# EAGLE design Lampduino-SMD-v001 (EAGLE 6.0)
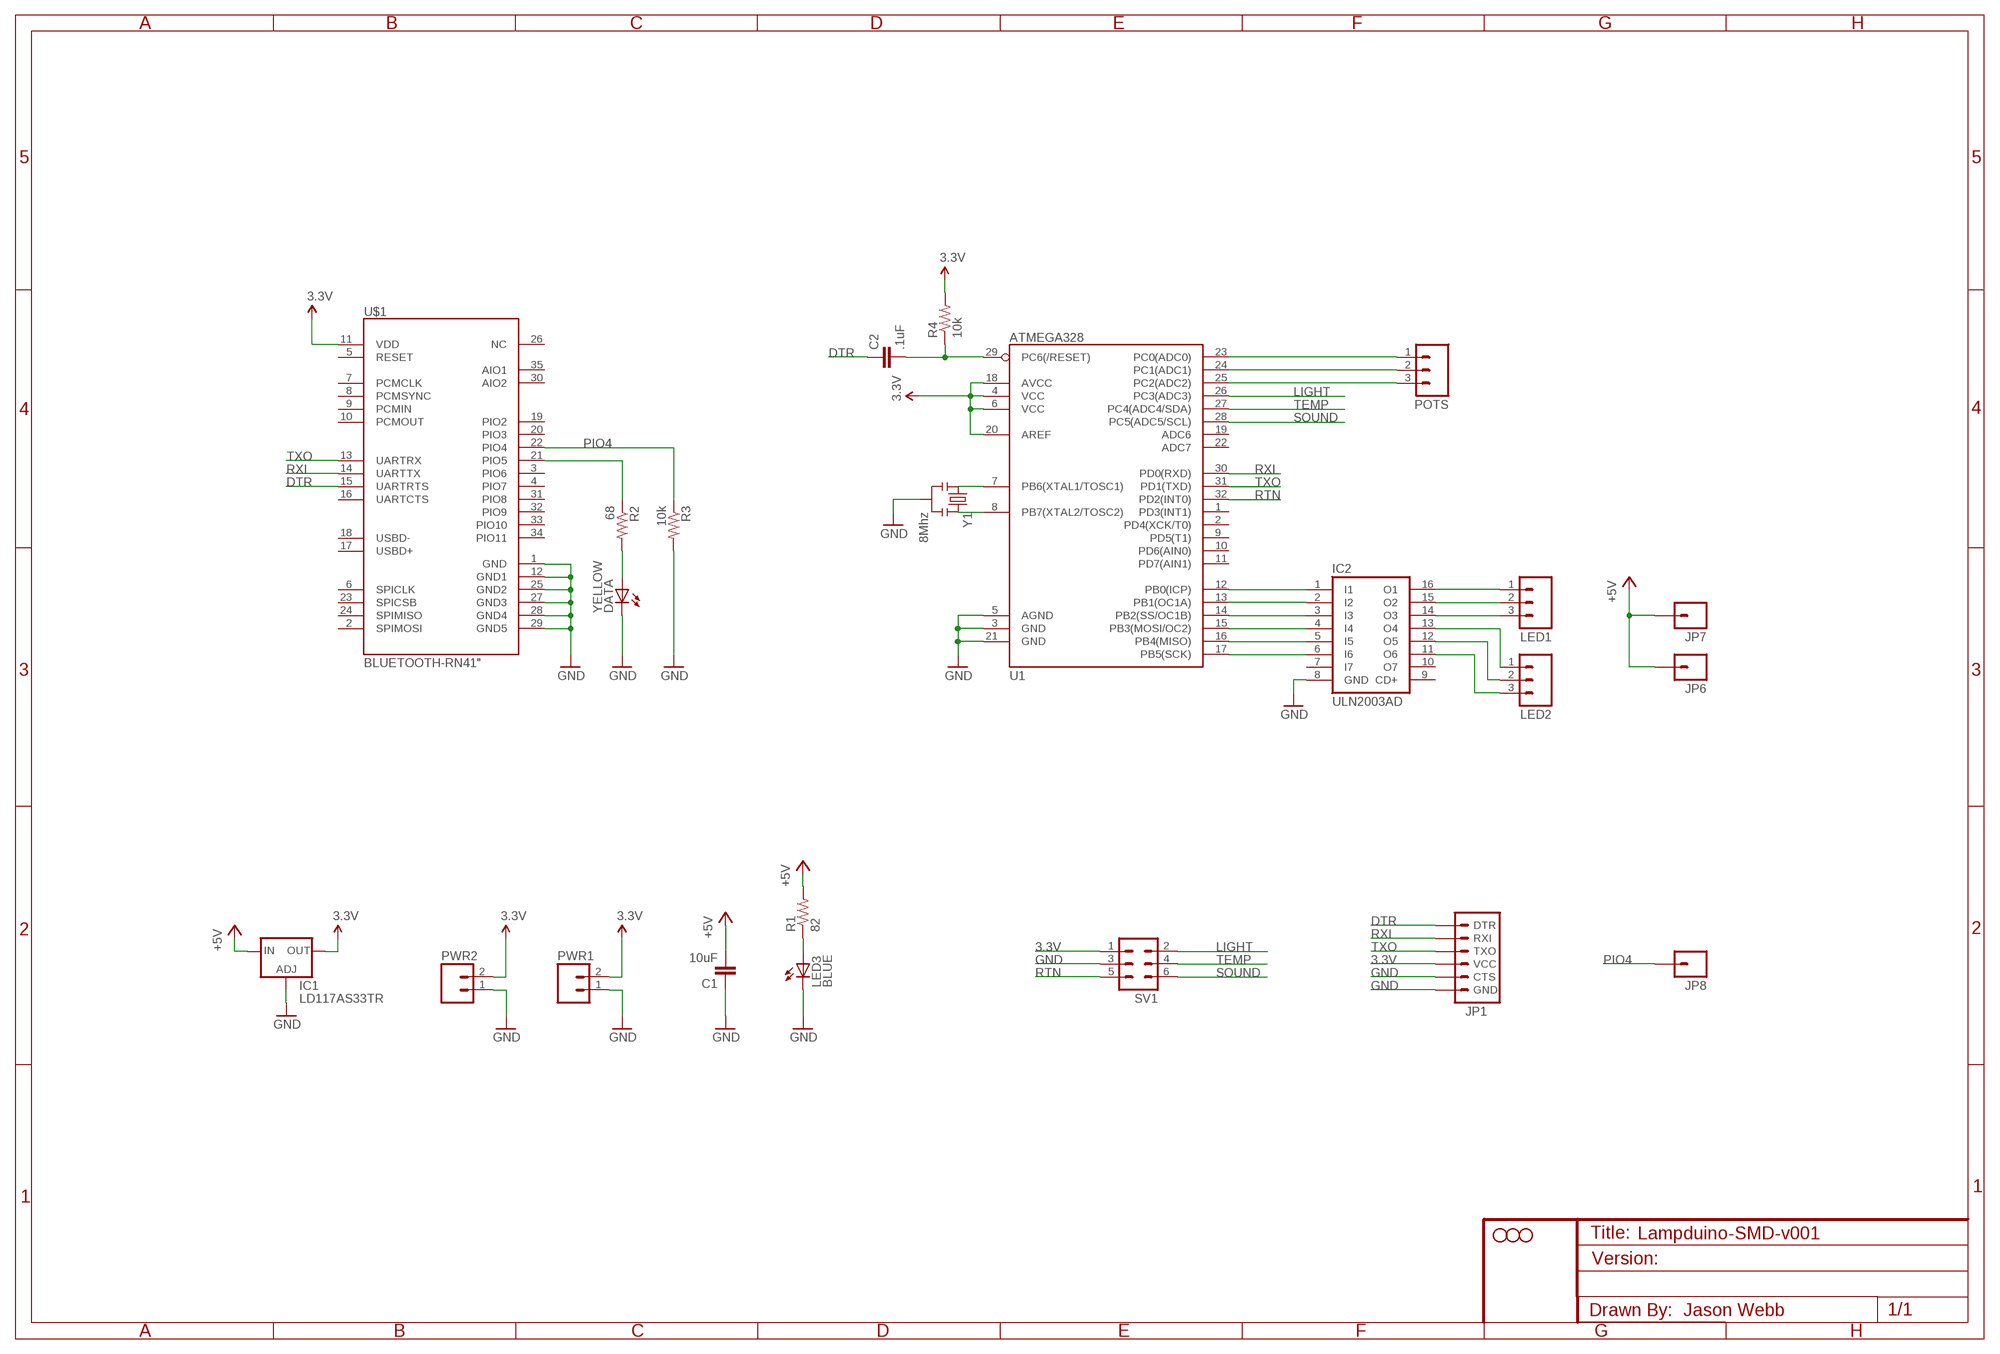
[diagram p0: schematic, sheet 1]

## Parts
C1  10uF  CAP0805  [0805]
C2  .1uF  CAP0805  [0805]
DATA  YELLOW  LEDCHIPLED_0603  [CHIPLED_0603]
IC1  LD117AS33TR  [SOT223]
IC2  ULN2003AD  [SO16]
JP1  ARDUINO_SERIAL_PROGRAMLOCK  [1X06_LOCK]
JP2  STAND-OFFTIGHT  [STAND-OFF-TIGHT]
JP4  STAND-OFFTIGHT  [STAND-OFF-TIGHT]
JP5  STAND-OFFTIGHT  [STAND-OFF-TIGHT]
JP6  M01PTH  [1X01]
JP7  M01PTH  [1X01]
JP8  M01PTH  [1X01]
LED1  M03PTH  [1X03]
LED2  M03PTH  [1X03]
LED3  BLUE  LEDCHIPLED_0603  [CHIPLED_0603]
POTS  M03PTH  [1X03]
PWR1  M02PTH  [1X02]
PWR2  M02PTH  [1X02]
R1  82  R-US_R0603  [R0603]
R2  68  R-US_R0603  [R0603]
R3  10k  R-US_R0603  [R0603]
R4  10k  R-US_R0603  [R0603]
SV1  ML6  [ML6]
U1  ATMEGA328  ATMEGA168  [TQFP32-08]
U$1  BLUETOOTH-RN41"  [RN41]
Y1  8Mhz  RESONATORSMD  [RESONATOR-SMD]

## Nets
3.3V: IC1.4(OUT) JP1.4(VCC) PWR1.2 PWR2.2 R4.2 SV1.1 U1.4(VCC) U1.6(VCC) U1.18(AVCC) U1.20(AREF) U$1.11(VDD)
+5V: C1.2 IC1.3(IN) JP6.1 JP7.1 R1.2
DTR: C2.1 JP1.1(DTR) U$1.15(UARTRTS)
GND: C1.1 DATA.C IC1.1(ADJ) IC2.8(GND) JP1.5(CTS) JP1.6(GND) LED3.C PWR1.1 PWR2.1 R3.2 SV1.3 U1.3(GND) U1.5(AGND) U1.21(GND) U$1.1(GND) U$1.12(GND1) U$1.25(GND2) U$1.27(GND3) U$1.28(GND4) U$1.29(GND5) Y1.2
LIGHT: SV1.2 U1.26(PC3(ADC3))
N$1: IC2.15(O2) LED1.2
N$2: IC2.4(I4) U1.15(PB3(MOSI/OC2))
N$3: IC2.14(O3) LED1.3
N$4: IC2.5(I5) U1.16(PB4(MISO))
N$5: IC2.16(O1) LED1.1
N$6: IC2.6(I6) U1.17(PB5(SCK))
N$7: U1.7(PB6(XTAL1/TOSC1)) Y1.1
N$8: U1.8(PB7(XTAL2/TOSC2)) Y1.3
N$9: LED3.A R1.1
N$10: C2.2 R4.1 U1.29(PC6(/RESET))
N$11: R2.1 U$1.21(PIO5)
N$12: POTS.3 U1.25(PC2(ADC2))
N$13: IC2.1(I1) U1.12(PB0(ICP))
N$14: IC2.2(I2) U1.13(PB1(OC1A))
N$15: IC2.3(I3) U1.14(PB2(SS/OC1B))
N$16: DATA.A R2.2
N$17: IC2.13(O4) LED2.1
N$18: IC2.12(O5) LED2.2
N$19: IC2.11(O6) LED2.3
N$20: POTS.2 U1.24(PC1(ADC1))
N$22: POTS.1 U1.23(PC0(ADC0))
PIO4: JP8.1 R3.1 U$1.22(PIO4)
RTN: SV1.5 U1.32(PD2(INT0))
RXI: JP1.2(RXI) U1.30(PD0(RXD)) U$1.14(UARTTX)
SOUND: SV1.6 U1.28(PC5(ADC5/SCL))
TEMP: SV1.4 U1.27(PC4(ADC4/SDA))
TXO: JP1.3(TXO) U1.31(PD1(TXD)) U$1.13(UARTRX)
Unconnected: IC2.7(I7) IC2.9(CD+) IC2.10(O7) U1.1(PD3(INT1)) U1.2(PD4(XCK/T0)) U1.9(PD5(T1)) U1.10(PD6(AIN0)) U1.11(PD7(AIN1)) U1.19(ADC6) U1.22(ADC7) U$1.2(SPIMOSI) U$1.3(PIO6) U$1.4(PIO7) U$1.5(RESET) U$1.6(SPICLK) U$1.7(PCMCLK) U$1.8(PCMSYNC) U$1.9(PCMIN) U$1.10(PCMOUT) U$1.16(UARTCTS) U$1.17(USBD+) U$1.18(USBD-) U$1.19(PIO2) U$1.20(PIO3) U$1.23(SPICSB) U$1.24(SPIMISO) U$1.26(NC) U$1.30(AIO2) U$1.31(PIO8) U$1.32(PIO9) U$1.33(PIO10) U$1.34(PIO11) U$1.35(AIO1)

## Notes on the sheet
- Jason Webb

## Library data of the parts
C1 C2 = SparkFun:CAP: Capacitor Standard 0603 ceramic capacitor, and 0.1" leaded capacitor.
DATA LED3 = led:LED: LED OSRAM: - CHIPLED LG R971, LG N971, LY N971, LG Q971, LY Q971, LO R971, LY R971 LH N974, LH R974 LS Q976, LO Q976, LY Q976 LO Q996 - Hyper CHIPLED LW Q18S LB Q993, LB Q99A, LB R99A - SideLED LS A670, LO A670, LY A670, LG A670, LP A670 LB A673, LV A673, LT A673, LW A673 LH A674 LY A675 LS A676, LA A676, LO A676, LY A676, LW A676 LS A679, LY A679, LG A679 - Hyper Micro SIDELED® LS Y876, LA Y876, LO Y876, LY Y876 LT Y87S - SmartLED LW L88C, LW L88S LB L89C, LB L89S, LG L890 LS L89K, LO L89K, LY L89K LS L896, LA L896, LO L896, LY L896 - TOPLED LS T670, LO T670, LY T670, LG T670, LP T670 LSG T670, LSP T670, LSY T670, LOP T670, LYG T670 LG T671, LOG T671, LSG T671 LB T673, LV T673, LT T673, LW T673 LH T674 LS T676, LA T676, LO T676, LY T676, LB T676, LH T676, LSB T676, LW T676 LB T67C, LV T67C, LT T67C, LS T67K, LO T67K, LY T67K, LW E67C LS E67B, LA E67B, LO E67B, LY E67B, LB E67C, LV E67C, LT E67C LW T67C LS T679, LY T679, LG T679 LS T770, LO T770, LY T770, LG T770, LP T770 LB T773, LV T773, LT T773, LW T773 LH T774 LS E675, LA E675, LY E675, LS T675 LS T776, LA T776, LO T776, LY T776, LB T776 LHGB T686 LT T68C, LB T68C - Hyper Mini TOPLED® LB M676 - Mini TOPLED Santana® LG M470 LS M47K, LO M47K, LY M47K Source: http://www.osram.convergy.de LUXEON: - LUMILED® LXK2-PW12-R00, LXK2-PW12-S00, LXK2-PW14-U00, LXK2-PW14-V00 LXK2-PM12-R00, LXK2-PM12-S00, LXK2-PM14-U00 LXK2-PE12-Q00, LXK2-PE12-R00, LXK2-PE12-S00, LXK2-PE14-T00, LXK2-PE14-U00 LXK2-PB12-K00, LXK2-PB12-L00, LXK2-PB12-M00, LXK2-PB14-N00, LXK2-PB14-P00, LXK2-PB14-Q00 LXK2-PR12-L00, LXK2-PR12-M00, LXK2-PR14-Q00, LXK2-PR14-R00 LXK2-PD12-Q00, LXK2-PD12-R00, LXK2-PD12-S00 LXK2-PH12-R00, LXK2-PH12-S00 LXK2-PL12-P00, LXK2-PL12-Q00, LXK2-PL12-R00 Source: www.luxeon.com KINGBRIGHT: KA-3528ASYC Source: www.kingbright.com
IC1 = v-reg:LD117A?*: Low drop fixed and adjustable positive voltage regulators 1 A Source: http://www.st.com/stonline/products/literature/ds/7194/ld1117axx.pdf
IC2 = uln-udn:ULN2003A: DRIVER ARRAY
JP1 = SparkFun:ARDUINO_SERIAL_PROGRAM
JP2 JP4 JP5 = SparkFun:STAND-OFF: Stand Off This is the mechanical footprint for a #4 phillips button head screw. Use the keepout ring to avoid running the screw head into surrounding components. SKU : PRT-00447
JP6-JP8 = SparkFun:M01: Header 1 Standard 1-pin 0.1" header. Use with straight break away headers (SKU : PRT-00116), right angle break away headers (PRT-00553), swiss pins (PRT-00743), machine pins (PRT-00117), and female headers (PRT-00115).
LED1 LED2 POTS = SparkFun:M03: Header 3 Standard 3-pin 0.1" header. Use with straight break away headers (SKU : PRT-00116), right angle break away headers (PRT-00553), swiss pins (PRT-00743), machine pins (PRT-00117), and female headers (PRT-00115). Molex polarized connector foot print use with SKU : PRT-08232 with associated crimp pins and housings.
PWR1 PWR2 = SparkFun:M02: Header 2 Standard 2-pin 0.1" header. Use with straight break away headers (SKU : PRT-00116), right angle break away headers (PRT-00553), swiss pins (PRT-00743), machine pins (PRT-00117), and female headers (PRT-00115). Molex polarized connector foot print use with SKU : PRT-08233 with associated crimp pins and housings.
R1-R4 = resistor:R-US_: RESISTOR, American symbol
SV1 = con-harting-ml:ML6: HARTING; OC_FARNELL: unknown; OC_NEWARK: unknown
U1 = SparkFun:ATMEGA168
U$1 = SparkFun:BLUETOOTH-RN41
Y1 = SparkFun:RESONATOR: Resonator Small SMD resonator. This is the itty bitty 10/20MHz resonators with built in caps. CSTCE10M0G55 and CSTCE20M0V53. Footprint has been reviewed closely but hasn't been tested yet.

## Board
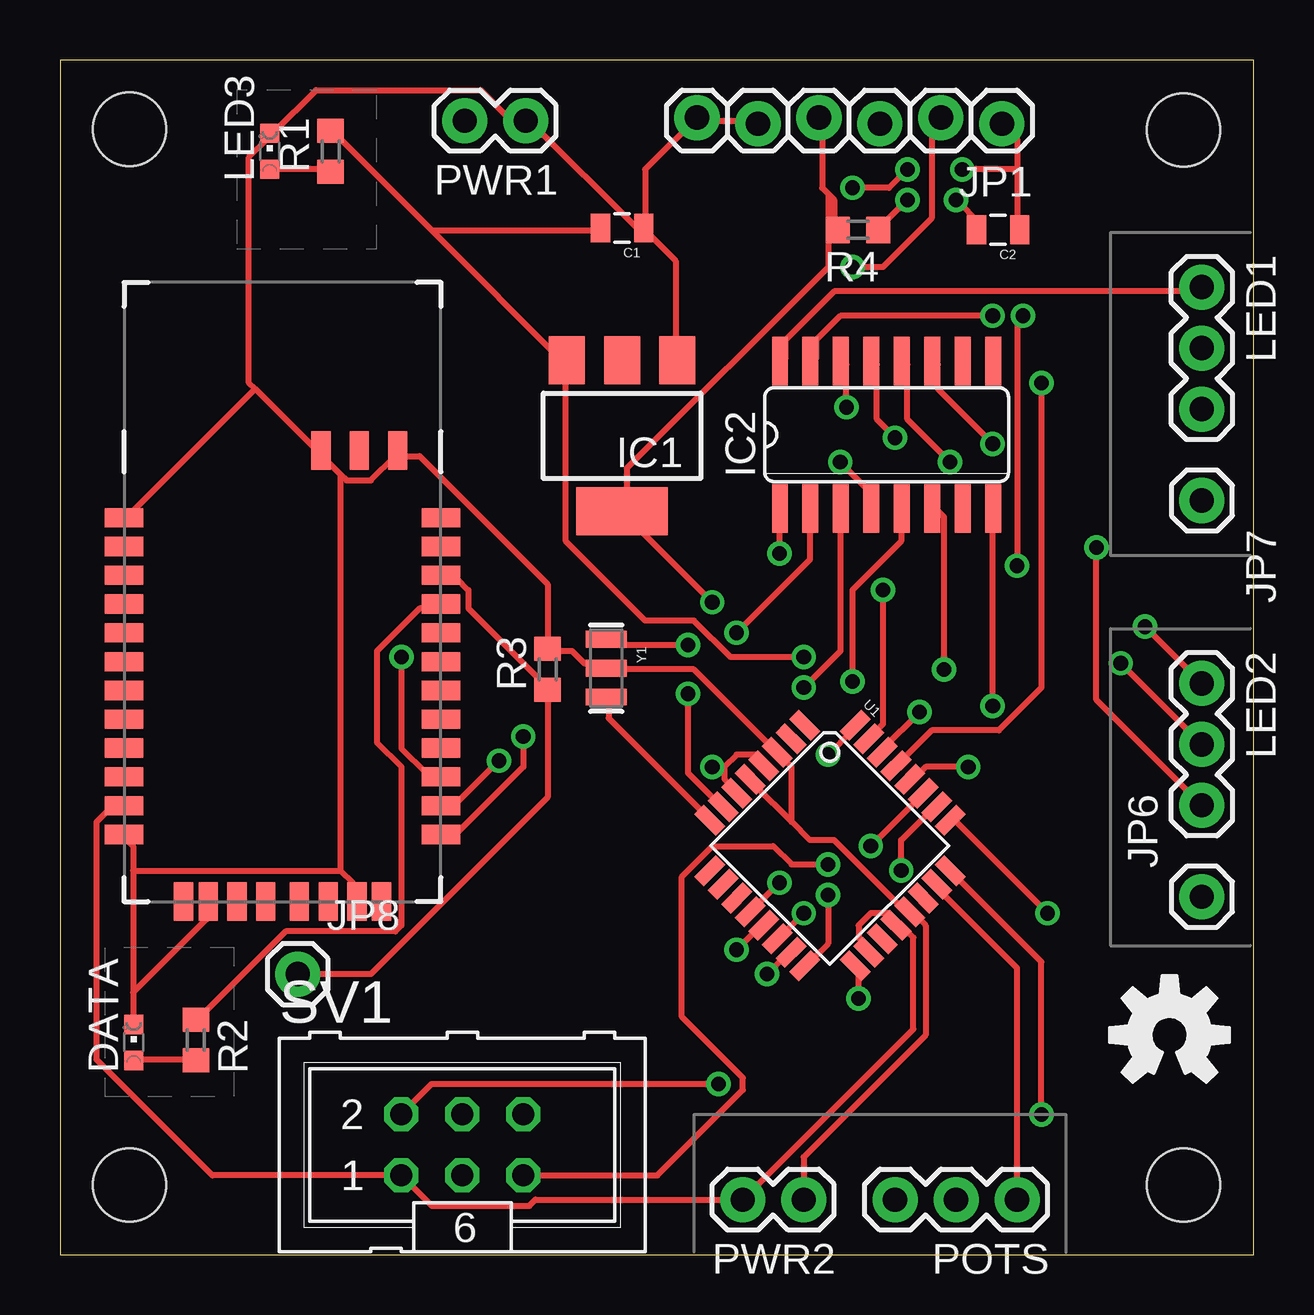
[diagram p1: board, top side]
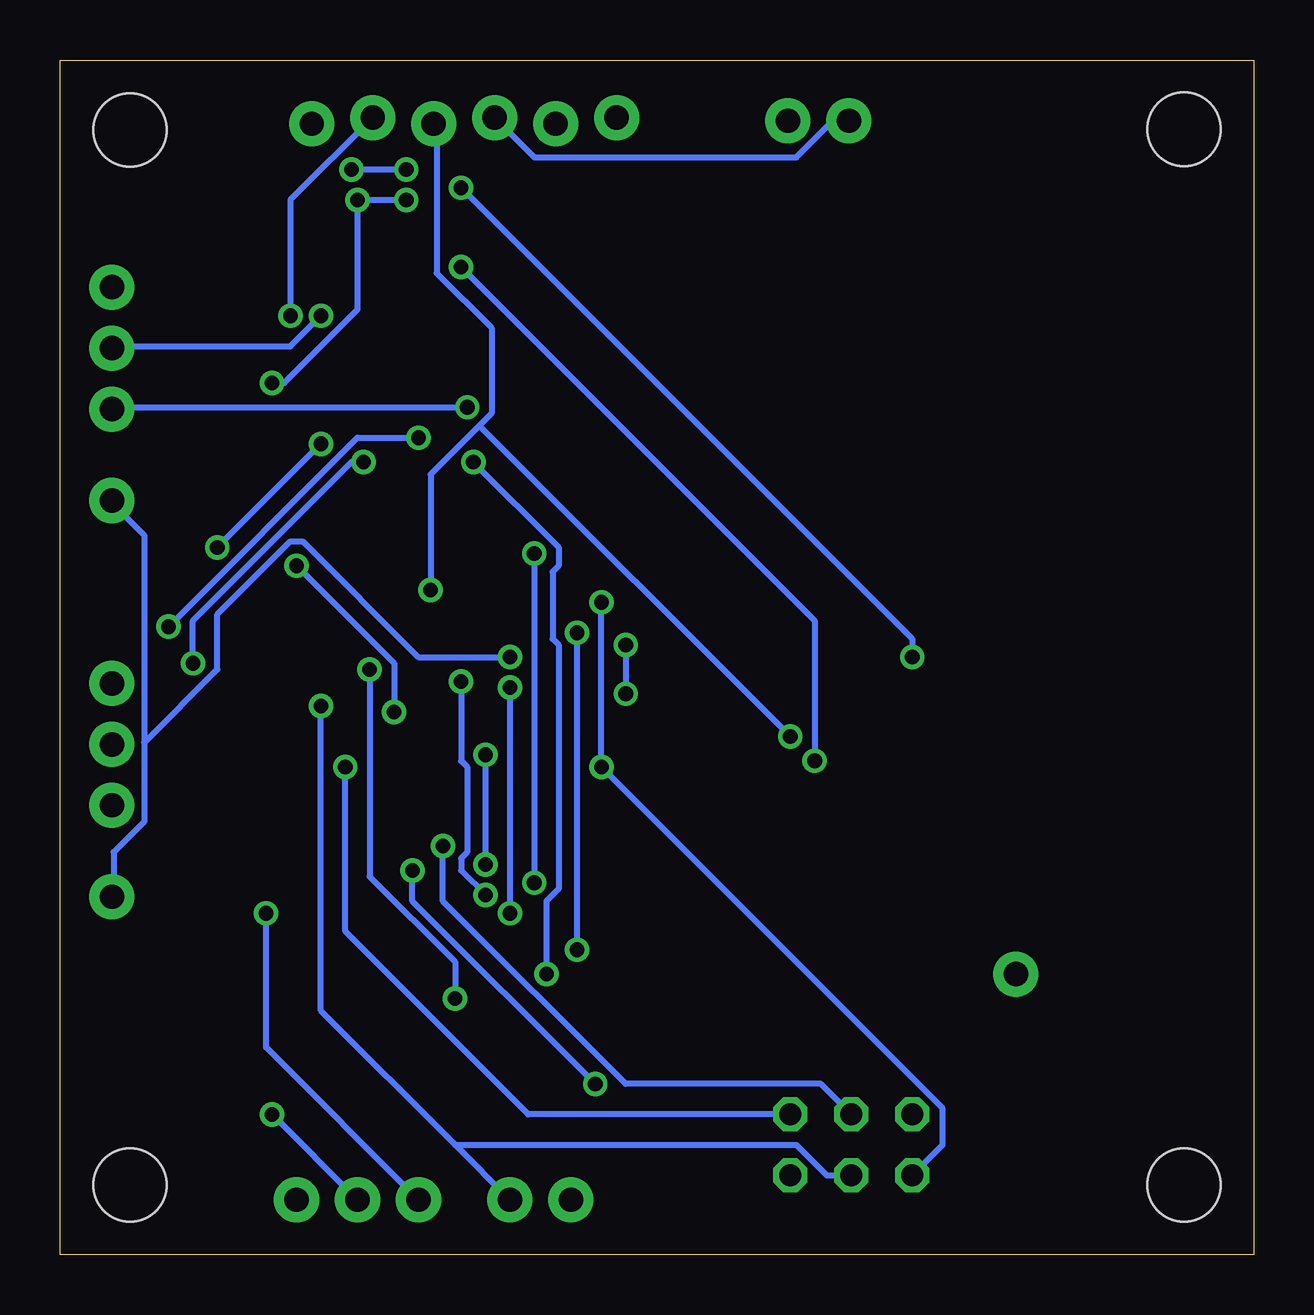
[diagram p2: board, bottom side, seen from below]

Size 49.73 x 49.77 mm. Coordinates in mm from the lower left corner, seen from the top.
Outline: 0,0 49.73,0 49.73,49.77 0,49.77 0,0
Copper layers (1*16): Top 0.035mm / dielectric 1.5mm / Bottom 0.035mm
Design rules: minimum track width 10mil, minimum drill 24mil, track to track 8mil, track to pad 8mil, pad to pad 8mil, via to via 8mil, smd to smd 8mil, copper to edge 40mil, drill to drill 8mil, minimum pad ring 10mil, minimum via ring 8mil, stop-mask expansion 4mil, vias tented up to drill 0mil, thermal gap 10mil

### Footprints (pad centres in the part's own frame; a part is rotated, then mirrored left to right if it is on the bottom)
0805 = smd 0.8 x 1.2: 1 -0.9,0; 2 0.9,0
CHIPLED_0603 = smd 0.8 x 0.8: A 0,-0.75; C 0,0.75
SOT223 = smd 1.5 x 2: 1 -2.3,-3.15; 2 0,-3.15; 3 2.3,-3.15 | smd 3.8 x 2: 4 0,3.15
SO16 = smd 0.66 x 2.032: 1 -4.445,-3.073; 2 -3.175,-3.073; 3 -1.905,-3.073; 4 -0.635,-3.073; 5 0.635,-3.073; 6 1.905,-3.073; 7 3.175,-3.073; 8 4.445,-3.073; 9 4.445,3.073; 10 3.175,3.073; 11 1.905,3.073; 12 0.635,3.073; 13 -0.635,3.073; 14 -1.905,3.073; 15 -3.175,3.073; 16 -4.445,3.073
1X06_LOCK = drill 1.016 pad 1.88: 1 0,0; 2 2.54,-0.254; 3 5.08,0; 4 7.62,-0.254; 5 10.16,0; 6 12.7,-0.254
STAND-OFF-TIGHT = hole 3.048: 0,0
1X01 = drill 1.016 pad 1.88: 1 0,0
1X03 = drill 1.016 pad 1.88: 1 0,0; 2 2.54,0; 3 5.08,0
1X02 = drill 1.016 pad 1.88: 1 0,0; 2 2.54,0
R0603 = smd 1 x 1.1: 1 -0.85,0; 2 0.85,0
ML6 = drill 0.914 octagon: 1 -2.54,-1.27; 2 -2.54,1.27; 3 0,-1.27; 4 0,1.27; 5 2.54,-1.27; 6 2.54,1.27
TQFP32-08 = smd 1.27 x 0.559: 1 -4.293,2.8; 2 -4.293,2; 3 -4.293,1.2; 4 -4.293,0.4; 5 -4.293,-0.4; 6 -4.293,-1.2; 7 -4.293,-2; 8 -4.293,-2.8; 17 4.293,-2.8; 18 4.293,-2; 19 4.293,-1.2; 20 4.293,-0.4; 21 4.293,0.4; 22 4.293,1.2; 23 4.293,2; 24 4.293,2.8 | smd 0.559 x 1.27: 9 -2.8,-4.293; 10 -2,-4.293; 11 -1.2,-4.293; 12 -0.4,-4.293; 13 0.4,-4.293; 14 1.2,-4.293; 15 2,-4.293; 16 2.8,-4.293; 25 2.8,4.293; 26 2,4.293; 27 1.2,4.293; 28 0.4,4.293; 29 -0.4,4.293; 30 -1.2,4.293; 31 -2,4.293; 32 -2.8,4.293
RN41 = smd 0.8 x 1.6: 1 -6.6,-6.6; 2 -5.4,-6.6; 3 -4.2,-6.6; 4 -3,-6.6; 5 -1.8,-6.6; 6 -0.6,-6.6; 7 0.6,-6.6; 8 1.8,-6.6; 9 3,-6.6; 10 4.2,-6.6; 11 5.4,-6.6; 12 6.6,-6.6; 13 6.6,6.6; 14 5.4,6.6; 15 4.2,6.6; 16 3,6.6; 17 1.8,6.6; 18 0.6,6.6; 19 -0.6,6.6; 20 -1.8,6.6; 21 -3,6.6; 22 -4.2,6.6; 23 -5.4,6.6; 24 -6.6,6.6 | smd 1.6 x 0.8: 25 -9.4,4.8; 26 -9.4,3.2; 27 -9.4,1.6; 28 9.4,3.1; 29 9.4,-3.1; 30 9.4,-4.122; 31 9.4,-1.9; 32 9.4,-0.7; 33 9.4,0.7; 34 9.4,1.9; 35 9.4,4.122
RESONATOR-SMD = smd 0.7 x 1.7: 1 -1.2,0; 2 0,0; 3 1.2,0

### Placement (x,y rotation side)
C1  23.42,42.77 180 top
C2  39.09,42.7 180 top
DATA  3.07,8.84 0 top
IC1  23.42,34.11 180 top
IC2  34.44,34.16 0 top
JP1  39.24,47.12 180 top
JP2  2.9,46.89 0 top
JP3  STAND-OFFTIGHT  [STAND-OFF-TIGHT]  46.81,46.86 0 top
JP4  46.81,2.9 0 top
JP5  2.9,2.9 0 top
JP6  47.57,14.91 90 top
JP7  47.57,31.42 270 top
JP8  9.91,11.68 0 top
LED1  47.57,40.31 270 top
LED2  47.57,23.8 270 top
LED3  8.74,45.97 0 top
POTS  39.88,2.29 180 top
PWR1  19.41,47.24 180 top
PWR2  30.99,2.29 180 top
R1  11.28,45.97 90 top
R2  5.66,8.94 270 top
R3  20.32,24.38 90 top
R4  33.25,42.7 180 top
SV1  16.76,4.57 0 top
U1  32.08,17.04 315 top
U$1  9.27,24.1 270 top
U$2  [OSHW-LOGO-M]  46.23,9.14 0 top
Y1  22.76,24.43 270 top

### Tracks (layer width: path | path; a pad name or v marks a point on that pad's centre or on a via)
3.3V  (via drill 0.61)
  Top 0.254: 32,44.2 31.75,44.45 31.75,47.24 JP1.4 | 32,44.2 32.26,43.94 32.26,42.93 R4.2 | 32,44.2 32,41.15 23.62,32.77 23.62,30.99 IC1.4 23.62,30.73 v27.18,27.18 | U1.18 33.53,12.7 33.53,12.95 33.27,13.21 33.27,13.72 33.78,14.22 34.54,14.22 34.8,13.97 U1.20 35.05,13.72 35.56,13.21 35.56,9.4 PWR2.2 19.81,2.29 19.56,2.03 15.49,2.03 SV1.1 6.35,3.3 1.52,8.13 1.52,18.03 2.03,18.54 2.54,18.54 U$1.11 | 27.69,20.32 27.69,19.81 28.19,19.3 U1.6 | 27.69,20.32 28.19,20.83 28.96,20.83 29.21,20.57 U1.4 | v27.18,20.32 27.69,20.32
  Bottom 0.254: PWR1.2 17.53,47.24 19.05,45.72 29.97,45.72 JP1.4 | SV1.1 12.95,4.57 12.95,6.1 v27.18,20.32 v27.18,27.18
+5V  (via drill 0.61)
  Top 0.254: 21.08,37.08 15.49,42.67 | 15.49,42.67 11.43,46.74 R1.2 | 15.49,42.67 22.35,42.67 C1.2 | 21.08,37.08 21.08,29.72 24.38,26.42 26.42,26.42 27.94,24.89 v30.99,24.89 | 21.08,37.08 IC1.3
  Bottom 0.254: 46.23,21.34 46.23,29.97 47.5,31.24 JP7.1 | 46.23,21.34 46.23,18.03 47.5,16.76 47.5,14.99 JP6.1 | v30.99,24.89 34.8,24.89 39.62,29.72 40.13,29.72 43.18,26.67 43.18,24.38 46.23,21.34
DTR  (via drill 0.61)
  Top 0.254: 39.88,45.21 39.88,46.48 JP1.1 | 39.88,45.21 39.88,42.93 C2.1 | v14.22,24.89 14.22,21.08 15.24,20.07 15.75,20.07 U$1.15 | v33.02,44.45 34.54,44.45 v35.31,45.21 | 39.88,45.21 v37.59,45.21
  Bottom 0.254: v14.22,24.89 14.22,25.65 v33.02,44.45 | v37.59,45.21 v35.31,45.21
GND  (via drill 0.61)
  Top 0.254: 38.86,31.24 IC2.8 38.86,30.99 v38.86,22.86 | C1.1 24.38,42.93 24.38,45.21 JP1.6 26.67,47.24 28.96,47.24 JP1.5 | IC1.1 25.65,37.34 25.65,41.4 24.38,42.67 C1.1 | C1.1 24.13,42.67 19.56,47.24 PWR1.1 18.8,47.24 17.53,48.51 10.67,48.51 8.89,46.74 LED3.C 8.64,46.48 7.87,45.72 7.87,36.32 8.13,36.07 | 30.48,18.03 31.24,17.27 32.26,17.27 35.31,14.22 U1.21 35.56,14.22 36.07,13.72 36.07,9.14 30.99,4.06 PWR2.1 | 30.48,18.03 28.96,19.56 U1.5 | 30.48,18.03 30.48,20.32 29.97,20.83 U1.3 29.72,21.08 26.42,24.38 22.86,24.38 Y1.2 22.61,24.64 21.84,24.64 21.34,25.15 20.32,25.15 R3.2 20.32,27.94 14.99,33.27 14.22,33.27 U$1.25 13.97,33.27 12.95,32.26 11.94,32.26 11.68,32.51 | 3.05,16 3.05,17.02 2.79,17.27 U$1.12 | 3.05,16 3.05,10.92 | 3.05,10.92 3.05,9.65 DATA.C | 3.05,10.92 6.1,13.97 6.1,14.48 U$1.29 | 11.68,16 12.19,15.49 12.19,14.73 U$1.28 | 3.05,16 11.68,16 | 8.13,36.07 10.67,33.53 U$1.27 10.92,33.27 11.68,32.51 | 8.13,36.07 2.79,30.73 U$1.1 | 11.68,32.51 11.68,16
  Bottom 0.254: v38.86,22.86 38.86,10.16 33.27,4.57 | PWR2.1 33.27,4.57 | SV1.3 17.78,3.3 19.05,4.57 33.27,4.57
LIGHT  (via drill 0.61)
  Top 0.254: v35.05,16 35.05,17.27 36.32,18.54 U1.26 | v27.43,7.11 15.49,7.11 SV1.2
  Bottom 0.254: v35.05,16 35.05,14.73 v27.43,7.11
N$1  (via drill 0.61)
  Top 0.254: v38.86,39.12 32.51,39.12 31.5,38.1 31.5,37.34 IC2.15
  Bottom 0.254: v38.86,39.12 40.13,37.85 47.5,37.85 LED1.2
N$2  (via drill 0.61)
  Top 0.254: v29.46,11.68 30.23,12.45 U1.15 | v32.51,33.02 33.78,31.75 33.78,31.24 IC2.4
  Bottom 0.254: v29.46,11.68 29.46,14.73 28.96,15.24 28.96,25.4 29.21,25.65 29.21,28.45 28.96,28.7 28.96,29.46 v32.51,33.02
N$3  (via drill 0.61)
  Top 0.254: v32.77,35.31 32.77,37.08 IC2.14
  Bottom 0.254: v32.77,35.31 47.5,35.31 LED1.3
N$4  (via drill 0.61)
  Top 0.254: v32,14.99 32,12.95 31.24,12.19 U1.16 | v33.02,23.88 33.02,27.69 35.05,29.72 35.05,30.99 IC2.5
  Bottom 0.254: v32,14.99 33.02,16 33.02,16.51 32.77,16.76 32.77,20.32 33.02,20.57 v33.02,23.88
N$5
  Top 0.254: IC2.16 30.23,37.34 30.23,38.1 32.26,40.13 47.5,40.13 LED1.1
N$6  (via drill 0.61)
  Top 0.254: v33.27,10.67 33.27,11.94 U1.17 | v36.83,24.38 36.83,30.73 36.58,30.99 IC2.6
  Bottom 0.254: v33.27,10.67 33.27,12.19 36.83,15.75 v36.83,24.38
N$7  (via drill 0.61)
  Top 0.254: v26.16,23.37 26.16,20.07 27.43,18.8 U1.7 | v26.16,25.4 22.86,25.4 Y1.1
  Bottom 0.254: v26.16,25.4 v26.16,23.37
N$8
  Top 0.254: U1.8 26.92,18.29 22.86,22.35 22.86,23.11 Y1.3
N$9
  Top 0.254: LED3.A 8.89,45.21 11.18,45.21 R1.1
N$10  (via drill 0.61)
  Top 0.254: v35.31,43.94 34.29,42.93 R4.1 | v37.34,43.94 38.35,42.93 C2.2 | v40.89,36.32 40.89,23.62 39.12,21.84 36.32,21.84 35.05,20.57 U1.29
  Bottom 0.254: v35.31,43.94 v37.34,43.94 37.34,39.37 40.39,36.32 v40.89,36.32
N$11
  Top 0.254: R2.1 5.84,9.91 9.4,13.46 13.97,13.46 14.22,13.72 14.22,20.32 13.21,21.34 13.21,25.15 14.99,26.92 15.75,26.92 U$1.21
N$12  (via drill 0.61)
  Top 0.254: v41.15,14.22 37.34,18.03 U1.25
  Bottom 0.254: v41.15,14.22 41.15,8.64 POTS.3
N$13  (via drill 0.61)
  Top 0.254: v29.97,15.49 28.96,14.48 U1.12 | v29.97,29.21 29.97,30.99 IC2.1
  Bottom 0.254: v29.97,29.21 v29.97,15.49
N$14  (via drill 0.61)
  Top 0.254: v28.19,12.7 29.21,13.72 U1.13 | v28.19,25.91 31.24,28.96 31.24,30.99 IC2.2
  Bottom 0.254: v28.19,25.91 v28.19,12.7
N$15  (via drill 0.61)
  Top 0.254: v30.99,14.22 29.97,13.21 U1.14 | v30.99,23.62 32.51,25.15 32.51,30.99 IC2.3
  Bottom 0.254: v30.99,23.62 v30.99,14.22
N$16
  Top 0.254: DATA.A 3.3,8.13 5.59,8.13 R2.2
N$17  (via drill 0.61)
  Top 0.254: v34.8,34.04 34.04,34.8 34.04,37.08 IC2.13 | LED2.1 v45.21,26.16
  Bottom 0.254: v34.8,34.04 37.34,34.04 v45.21,26.16
N$18  (via drill 0.61)
  Top 0.254: v37.08,33.02 35.31,34.8 35.31,37.08 IC2.12 | LED2.2 v44.2,24.64
  Bottom 0.254: v37.08,33.02 37.59,33.02 44.2,26.42 v44.2,24.64
N$19  (via drill 0.61)
  Top 0.254: v38.86,33.78 36.58,36.07 36.58,37.08 IC2.11 | v43.18,29.46 43.18,23.11 LED2.3
  Bottom 0.254: v43.18,29.46 v38.86,33.78
N$20  (via drill 0.61)
  Top 0.254: v40.89,5.84 40.89,12.19 37.34,15.75 U1.24
  Bottom 0.254: POTS.2 v40.89,5.84
N$22
  Top 0.254: POTS.1 39.88,11.94 36.58,15.24 U1.23
PIO4
  Top 0.254: U$1.22 16,28.19 16.51,28.19 17.02,27.69 17.02,26.92 20.32,23.62 R3.1 20.32,19.05 12.95,11.68 JP8.1
RTN  (via drill 0.61)
  Top 0.254: v32,20.83 33.02,21.84 U1.32 | v32,16.26 30.48,16.26 29.72,17.02 27.18,17.02 25.91,15.75 25.91,9.91 28.45,7.37 28.45,6.86 24.89,3.3 SV1.5
  Bottom 0.254: v32,16.26 v32,20.83
RXI  (via drill 0.61)
  Top 0.254: v35.81,22.61 34.29,21.08 U1.30 | v39.88,28.7 39.88,38.86 v40.13,39.12 | v18.29,20.57 16.51,18.8 16,18.8 U$1.14 | v33.02,41.15 34.29,41.15 36.32,43.18 36.32,46.99 JP1.2
  Bottom 0.254: v35.81,22.61 35.81,24.64 v39.88,28.7 | v40.13,39.12 40.13,43.94 JP1.2 | v18.29,20.57 18.29,26.42 v33.02,41.15
SOUND  (via drill 0.61)
  Top 0.254: v37.85,20.32 36.07,20.32 35.56,19.81 U1.28
  Bottom 0.254: v37.85,20.32 37.85,13.46 30.23,5.84 SV1.6
TEMP  (via drill 0.61)
  Top 0.254: v33.78,17.02 35.81,19.05 U1.27
  Bottom 0.254: v33.78,17.02 33.78,14.73 26.16,7.11 18.03,7.11 SV1.4
TXO  (via drill 0.61)
  Top 0.254: v34.29,27.69 34.29,22.1 33.78,21.59 U1.31 | v19.3,21.59 19.3,20.32 16.51,17.53 16,17.53 U$1.13
  Bottom 0.254: v34.29,27.69 34.29,32.51 32.26,34.54 | 32.26,34.54 31.75,35.05 31.75,38.61 34.04,40.89 34.04,46.99 JP1.3 | 32.26,34.54 v19.3,21.59

### Text on the board
tDocu: +5V | GND | FTDI | POWER | R | G | ULN2003 | B | LED1 | + | RN-42 | BLUETOOTH | R | G | LED2 | B | ATMEGA328 | + | DATA | SENSORS | POTS | + | - | 1 | 2 | 3